# Altium schematic sheet Power.SchDoc
size A; SheetNumber: 3; SheetTotal: 6
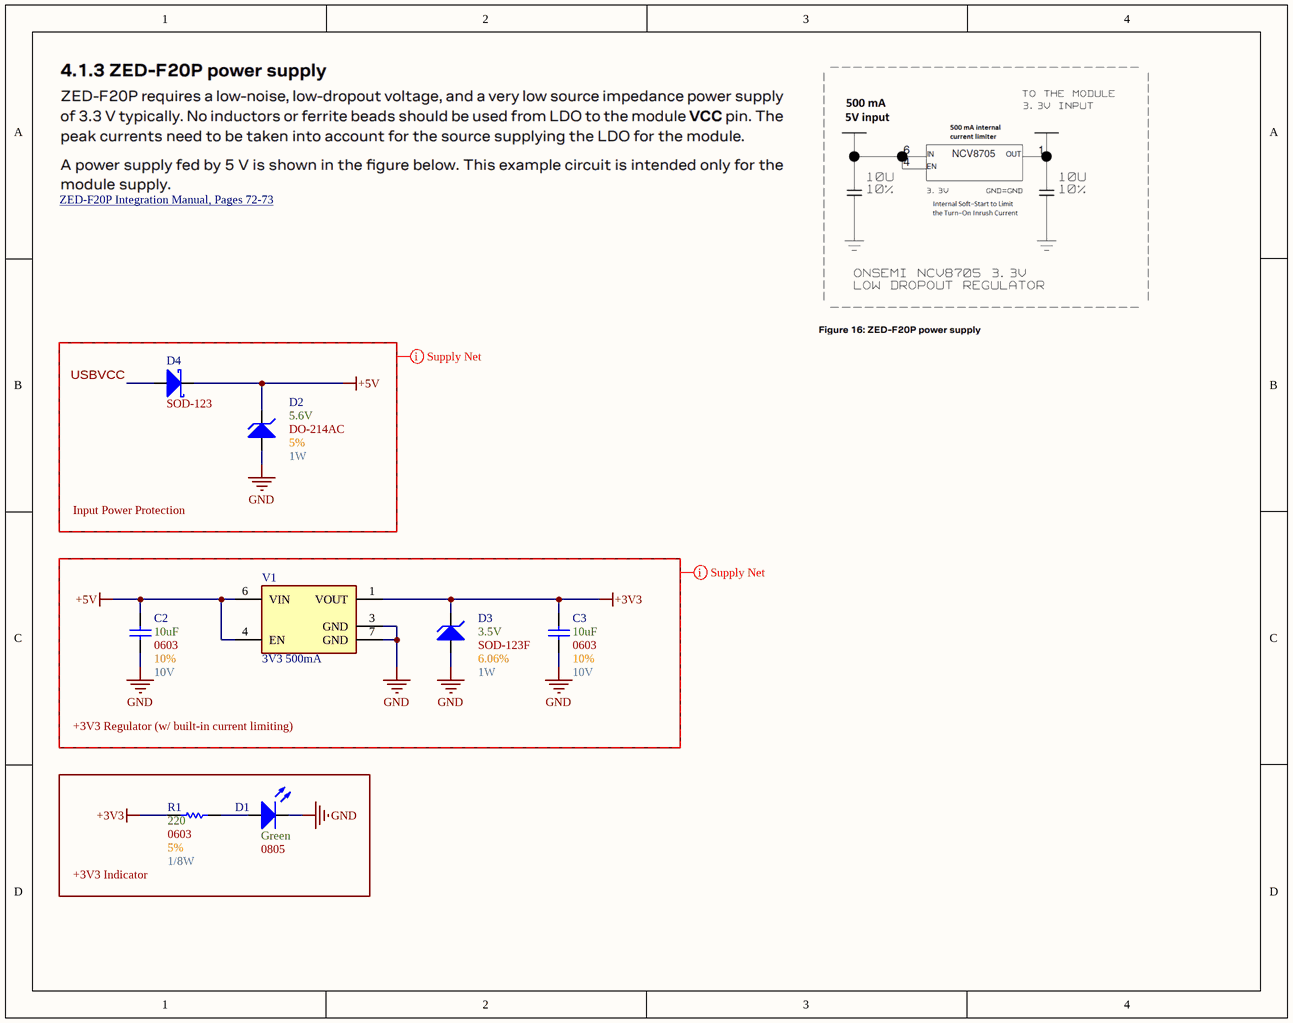
[diagram p0: Power.SchDoc]

## Parts
C2  Max Voltage: 10V  Size Package: 0603  Tolerance: 10%  Capacitance: 10uF  [[Cap] SMD 0603]  (hidden comment: [Cap] 0603 10uF 10% 10V)
C3  Max Voltage: 10V  Size Package: 0603  Tolerance: 10%  Capacitance: 10uF  [[Cap] SMD 0603]  (hidden comment: [Cap] 0603 10uF 10% 10V)
D1  Color: Green  Size Package: 0805  [[LED] SMD 0805]  (hidden comment: [LED] SMD 0805 Green)
D2  Tolerance: 5%  Wattage: 1W  Optimal Zener Voltage: 5.6V  [[Diode] SMD DO-214AC]  (hidden comment: DO-214AC)
D3  Tolerance: 6.06%  Wattage: 1W  Optimal Zener Voltage: 3.5V  [[Diode] SOD-123F]  (hidden comment: SOD-123F)
D4  Footprint: SOD-123  [[Diode] SMD SOD-123]  (hidden comment: SOD123)
R1  Wattage: 1/8W  Tolerance: 5%  Resistance: 220  Size Package: 0603  [[Res] SMD 0603]  (hidden comment: [220] SMD 0603 5% 1/10W)
V1  3V3 500mA  [[Linear] 3V3 0.5A]

## Blocks framed on the sheet
Input Power Protection: D2 D4
+3V3 Regulator (w/ built-in current limiting): C2 C3 D3 V1
+3V3 Indicator: D1 R1

## Nets
+3V3: C3.2 D3.1(K) R1.1 V1.1(VOUT)
+5V: C2.2 D2.1(K) D4.1(K) V1.4(EN) V1.6(VIN)
GND: C2.1 C3.1 D1.2(Cathode) D2.2(A) D3.2(A) V1.3(GND) V1.7(GND)
USBVCC: D4.2(A)
NetD1_1: D1.1(Anode) R1.2

## Layout directives
net class Supply_Nets: +3V3, +5V, GND, USBVCC

## Notes on the sheet
- ZED-F20P Integration Manual, Pages 72-73 <https://content.u-blox.com/sites/default/files/documents/ZED-F20P_IntegrationManual_UBXDOC-304424225-19671.pdf#page=72>

## Library data of the parts
C2 C3 = [Cap] 0603 10uF 10% 10V: CL10A106KP8NNNC; Supplier 1: DigiKey; Supplier Part Number 1: 1276-1192-6-ND
D1 = [LED] SMD 0805 Green: LG R971-KN-1-0-20-R18; Supplier 1: DigiKey; Supplier Part Number 1: 475-LGR971-KN-1CT-ND
D2 = [Zener] SMD 5.6V 1W 5%: SMAZ5V6-13-F; Supplier 1: DigiKey; Supplier Part Number 1: SMAZ5V6-FDICT-ND; Footprint: DO-214AC
D3 = [Zener] SMD 3.5V 1W 6%: KDZVTR3.3B; Supplier 1: DigiKey; Supplier Part Number 1: 846-KDZVTR3.3BCT-ND; Footprint: SOD-123F
D4 = [Schottky] SMD 40V 1A: B5819W-TP; Supplier 1: DigiKey; Supplier Part Number 1: B5819W-TPMSCT-ND
R1 = [220] SMD 0603 5% 1/10W: RK73B1JTTD221J; Supplier 1: DigiKey; Supplier Part Number 1: 2019-RK73B1JTTD221JDKR-ND
V1 = [Linear] 3V3 0.5A: NCV8705MT33TCG; Supplier 1: DigiKey; Supplier Part Number 1: NCV8705MT33TCGOSDKR-ND